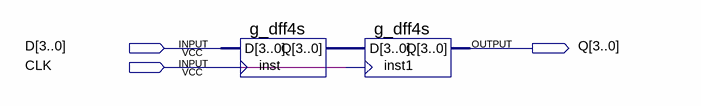
[diagram p0: schematic sheet]
// Quartus schematic sr2x4.bdf as structural Verilog: 2 symbols, 3 pins
module sr2x4 (
  input  [3:0] D,
  input  CLK,
  output [3:0] Q
);

  wire [3:0] inst_q;

  g_dff4s inst (.data(D), .clock(CLK), .q(inst_q));
  g_dff4s inst1 (.data(inst_q), .clock(CLK), .q(Q));
endmodule
